# Altium schematic sheet 13_FLOW_Sensor.SchDoc
size 420 x 297 mm; SheetNumber: 13; SheetTotal: 27
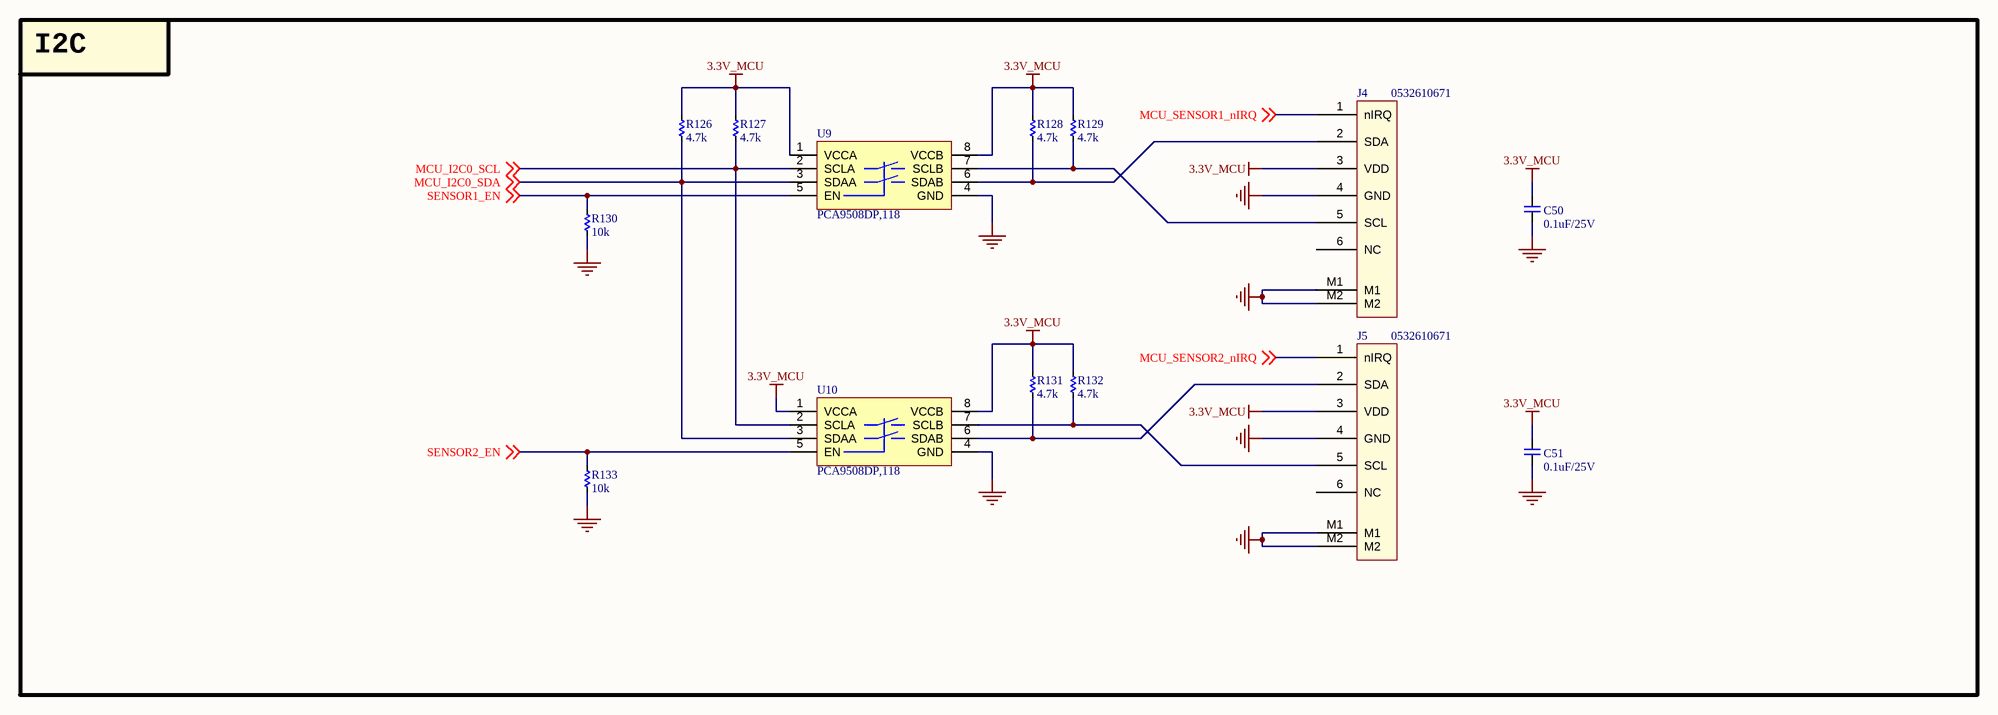
[diagram p0: 13_FLOW_Sensor.SchDoc]

## Parts
C50  0.1uF/25V  [CAP_C_1005X60]
C51  0.1uF/25V  [CAP_C_1005X60]
J4  0532610671  [MOLEX_0532610671]
J5  0532610671  [MOLEX_0532610671]
R126  4.7k  [RES_C_1005X40]
R127  4.7k  [RES_C_1005X40]
R128  4.7k  [RES_C_1005X40]
R129  4.7k  [RES_C_1005X40]
R130  10k  [RES_C_1005X40]
R131  4.7k  [RES_C_1005X40]
R132  4.7k  [RES_C_1005X40]
R133  10k  [RES_C_1005X40]
U9  PCA9508DP,118  [TSOP8]
U10  PCA9508DP,118  [TSOP8]

## Blocks framed on the sheet
I2C: C50 C51 J4 J5 R126-R133 U9 U10

## Nets
3.3V_MCU: C50.2 C51.2 J4.3(VDD) J5.3(VDD) R126.1 R127.1 R128.1 R129.1 R131.1 R132.1 U9.1(VCCA) U9.8(VCCB) U10.1(VCCA) U10.8(VCCB)
GND: C50.1 C51.1 J4.4(GND) J4.M1 J4.M2 J5.4(GND) J5.M1 J5.M2 R130.2 R133.2 U9.4(GND) U10.4(GND)
MCU_I2C0_SCL: R127.2 U9.2(SCLA) U10.2(SCLA) ; off-sheet MCU_I2C0_SCL
MCU_I2C0_SDA: R126.2 U9.3(SDAA) U10.3(SDAA) ; off-sheet MCU_I2C0_SDA
MCU_SENSOR1_nIRQ: J4.1(nIRQ) ; off-sheet MCU_SENSOR1_nIRQ
MCU_SENSOR2_nIRQ: J5.1(nIRQ) ; off-sheet MCU_SENSOR2_nIRQ
SENSOR1_EN: R130.1 U9.5(EN) ; off-sheet SENSOR1_EN
SENSOR2_EN: R133.1 U10.5(EN) ; off-sheet SENSOR2_EN
NetJ4_2: J4.2(SDA) R128.2 U9.6(SDAB)
NetJ4_5: J4.5(SCL) R129.2 U9.7(SCLB)
NetJ5_2: J5.2(SDA) R131.2 U10.6(SDAB)
NetJ5_5: J5.5(SCL) R132.2 U10.7(SCLB)

Not connected (* = marked no-connect by the designer): J4 6(NC); J5 6(NC)

## Notes on the sheet
- Project
- Sub-system:
- Design by:
- Sheet title:
- Sheet:
- of
- Checked by:
- Approved by:
- Doc no:
- Revision
- Size:
- Date:

## Library data of the parts
C50 C51 = _CAP_C_2: CAP
J4 J5 = FLOW_SENSOR
R126-R133 = _RES_B_2: RES